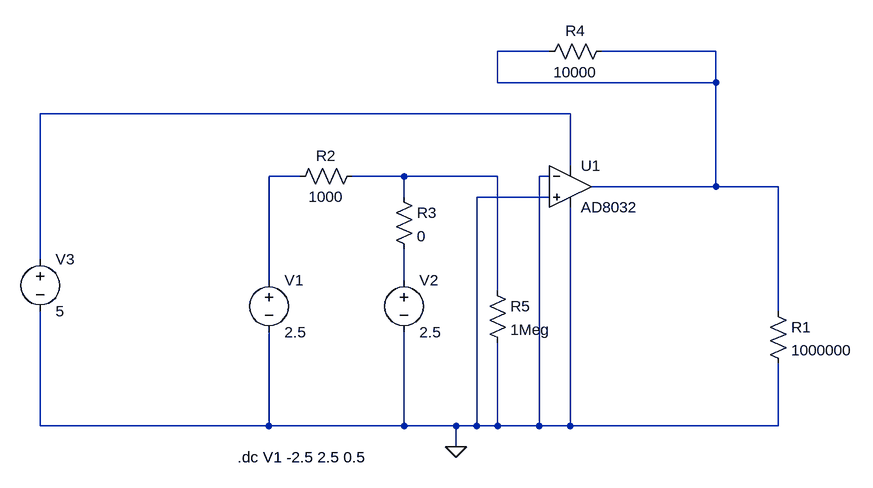
[diagram p0: schematic Draft1.asc]
Draft1.asc, the LTspice schematic file:
Version 4
SHEET 1 880 680
WIRE 256 -352 176 -352
WIRE 512 -352 336 -352
WIRE 176 -304 176 -352
WIRE 512 -304 512 -352
WIRE 512 -304 176 -304
WIRE 288 -256 -528 -256
WIRE 288 -176 288 -256
WIRE -128 -160 -176 -160
WIRE 32 -160 -48 -160
WIRE 176 -160 32 -160
WIRE 256 -160 240 -160
WIRE 512 -144 512 -304
WIRE 512 -144 320 -144
WIRE 608 -144 512 -144
WIRE 32 -128 32 -160
WIRE 256 -128 144 -128
WIRE -528 -32 -528 -256
WIRE -176 0 -176 -160
WIRE 32 0 32 -48
WIRE 176 16 176 -160
WIRE 608 48 608 -144
WIRE -528 224 -528 48
WIRE -176 224 -176 80
WIRE -176 224 -528 224
WIRE 32 224 32 80
WIRE 32 224 -176 224
WIRE 112 224 32 224
WIRE 144 224 144 -128
WIRE 144 224 112 224
WIRE 176 224 176 96
WIRE 176 224 144 224
WIRE 240 224 240 -160
WIRE 240 224 176 224
WIRE 288 224 288 -112
WIRE 288 224 240 224
WIRE 608 224 608 128
WIRE 608 224 288 224
WIRE 112 256 112 224
FLAG 112 256 0
SYMBOL voltage -176 -16 R0
WINDOW 123 0 0 Left 0
WINDOW 39 0 0 Left 0
SYMATTR InstName V1
SYMATTR Value 2.5
SYMBOL res 592 32 R0
SYMATTR InstName R1
SYMATTR Value 1000000
SYMBOL res -32 -176 R90
WINDOW 0 0 56 VBottom 2
WINDOW 3 32 56 VTop 2
SYMATTR InstName R2
SYMATTR Value 1000
SYMBOL OpAmps\\AD8032 288 -208 R0
SYMATTR InstName U1
SYMBOL res 352 -368 R90
WINDOW 0 0 56 VBottom 2
WINDOW 3 32 56 VTop 2
SYMATTR InstName R4
SYMATTR Value 10000
SYMBOL voltage -528 -48 R0
WINDOW 123 0 0 Left 0
WINDOW 39 0 0 Left 0
SYMATTR InstName V3
SYMATTR Value 5
SYMBOL voltage 32 -16 R0
WINDOW 123 0 0 Left 0
WINDOW 39 0 0 Left 0
SYMATTR InstName V2
SYMATTR Value 2.5
SYMBOL res 16 -144 R0
SYMATTR InstName R3
SYMATTR Value 0
SYMBOL res 160 0 R0
SYMATTR InstName R5
SYMATTR Value 1Meg
TEXT -224 272 Left 2 !.dc V1 -2.5 2.5 0.5

The netlist it stands for:
* Draft1.asc
V1 N003 0 2.5
R1 N001 0 1000000
R2 N004 N003 1000
XU1 0 0 N002 0 N001 AD8032  ; pins In+ In- V+ V- OUT
R4 N001 N001 10000
V3 N002 0 5
V2 N005 0 2.5
R3 N004 N005 0
R5 N004 0 1Meg
.dc V1 -2.5 2.5 0.5
.backanno
.end